# EAGLE design Transmitter (EAGLE 9.2.2)
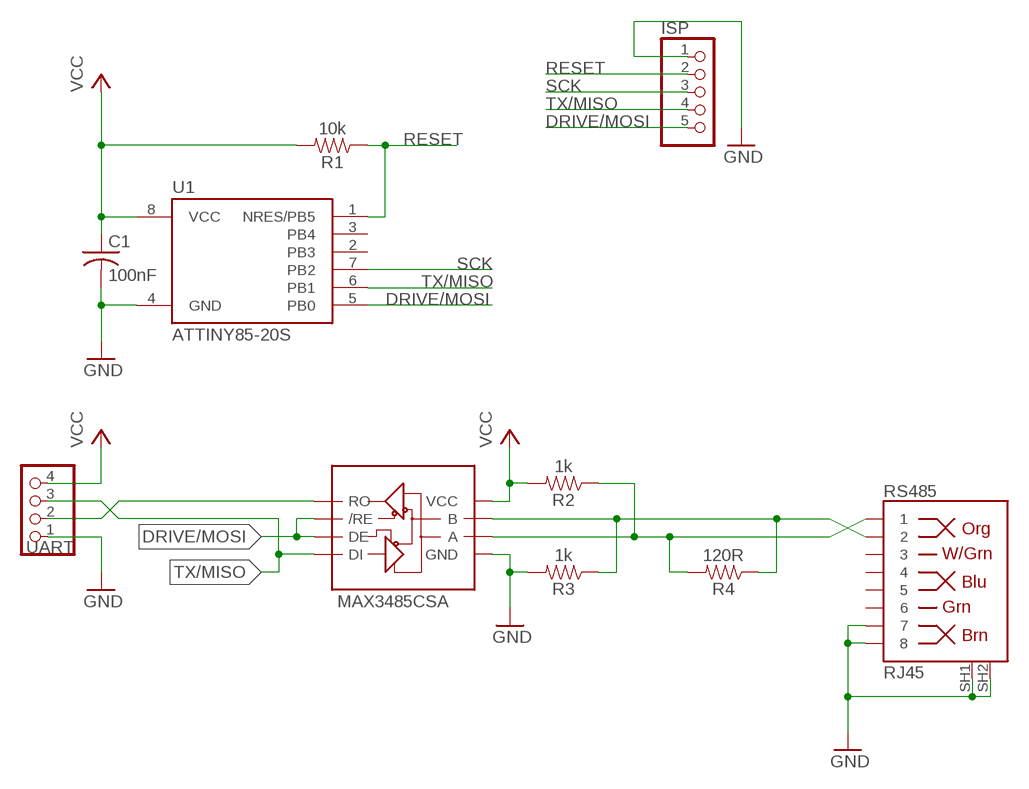
[diagram p0: schematic, sheet 1]

## Parts
C1  100nF  C-USC0603  [C0603]
ISP  PINHD-1X5  [1X05]
R1  10k  10KOHM-0603-1/10W-1%  [0603]
R2  1k  1KOHM-0603-1/10W-1%  [0603]
R3  1k  1KOHM-0603-1/10W-1%  [0603]
R4  120R  RESISTOR0805  [0805]
RS485  RJ45  RJ45-8  [RJ45-8]
U1  ATTINY85-20S  [SOIC8_EIAJ_208MIL]
U2  MAX3485CSA  RS485SOIC  [SO08]
UART  PINHD-1X4  [1X04]

## Nets
A: R2.1 R4.2 RS485.1 U2.6(A)
B: R3.1 R4.1 RS485.2 U2.7(B)
DRIVE/MOSI: ISP.5 U1.5(PB0) U2.2(/RE) U2.3(DE)
GND: C1.2 ISP.1 R3.2 RS485.7 RS485.8 RS485.SH1 RS485.SH2 U1.4(GND) U2.5(GND) UART.1
RESET: ISP.2 R1.1 U1.1(NRES/PB5)
RX: U2.1(RO) UART.2
SCK: ISP.3 U1.7(PB2)
TX/MISO: ISP.4 U1.6(PB1) U2.4(DI) UART.3
VCC: C1.1 R1.2 R2.2 U1.8(VCC) U2.8(VCC) UART.4
Unconnected: RS485.3 RS485.4 RS485.5 RS485.6 U1.2(PB3) U1.3(PB4)

## Library data of the parts
C1 = adafruit:C-US: CAPACITOR, American symbol; MPN: CC0201KRX5R5BB104; OC_NEWARK: 68R4547
ISP = pinhead:PINHD-1X5: PIN HEADER; OC_NEWARK: unknown
R1 = SparkFun-Resistors:10KOHM: 10kΩ resistor A resistor is a passive two-terminal electrical component that implements electrical resistance as a circuit element. Resistors act to reduce current flow, and, at the same time, act to lower voltage levels within circuits. - Wikipedia; OC_NEWARK: unknown; PROD_ID: RES-00824
R2 R3 = SparkFun-Resistors:1KOHM: 1kΩ resistor A resistor is a passive two-terminal electrical component that implements electrical resistance as a circuit element. Resistors act to reduce current flow, and, at the same time, act to lower voltage levels within circuits. - Wikipedia; OC_NEWARK: unknown; PROD_ID: RES-07856
R4 = SparkFun-Resistors:RESISTOR: Generic Resistor Package; OC_NEWARK: unknown
RS485 = SparkFun-Connectors-MyRJ:RJ45-8: RJ45 Jack - 8 pin Simple RJ45, 8-pin connection. Commonly used for Cat5, Cat5e, and Cat6 Ethernet cables. Here is the connector we sell at SparkFun: RJ45 8-Pin Connector <https://www.sparkfun.com/products/643> (PRT-00643) Datasheet <https://cdn.sparkfun.com/datasheets/Prototyping/04908.pdf> It is used on this SparkFun product: SparkFun RJ45 Breakout <https://www.sparkfun.com/products/716> (BOB-00716) Note, you may also be interested in the "MAGJACK" version of this. It is basically a RJ45 connector, but also has some status LEDs built into the connector housing. You can check that out in this library at the device named "MAGJACK.dev" and see these products online: RJ45 Ethernet MagJack-Compatible <https://www.sparkfun.com/products/8534> (PRT-08534) SparkFun RJ45 MagJack Breakout <https://www.sparkfun.com/products/13021> (BOB-13021); OC_NEWARK: unknown; PROD_ID: CONN-08506; SF_ID: PRT-00643
U1 = _hhn_attiny25_45_85:ATTINY85*: ATMEL ATtiny 85 Packages: P = PDIP 08 30mil S = SOIC 08 EIAJ 208mil Technologies Note: for complete ordering code (temp. range, finish, tape&reel etc.) see www.atmel.com • Supply Voltage: V = (1.8…5.5)V | [blank] = (2.7…5.5)V • Speed: 10 = 10 MHz | 20 = 20 MHz Author: Dipl.-Ing. FH Rainer Bayer HHN Hochschule Heilbronn (Heilbronn University), rainer.bayer@hs-heilbronn.de Ingenieurbüro ing-rb, mail@ing-rb.de; OC_NEWARK: unknown
U2 = SparkFun-IC-Comms:RS485: RS-485 Transceiver SP3485 Series 8 Pin NSOIC 3.3 V Low Power Half Duplex RS-485 Transceiver MAX3485 compatible Datasheet <http://www.sparkfun.com/datasheets/Components/General/sp3485CN-LTR.pdf> SparkFun Products SparkFun Transceiver Breakout - RS-485 <https://www.sparkfun.com/products/10124> (BOB-10124) SparkFun USB to RS-485 Converter <https://www.sparkfun.com/products/9822> (BOB-09822); OC_NEWARK: unknown; PROD_ID: IC-09388
UART = pinhead:PINHD-1X4: PIN HEADER; OC_NEWARK: unknown

## Board
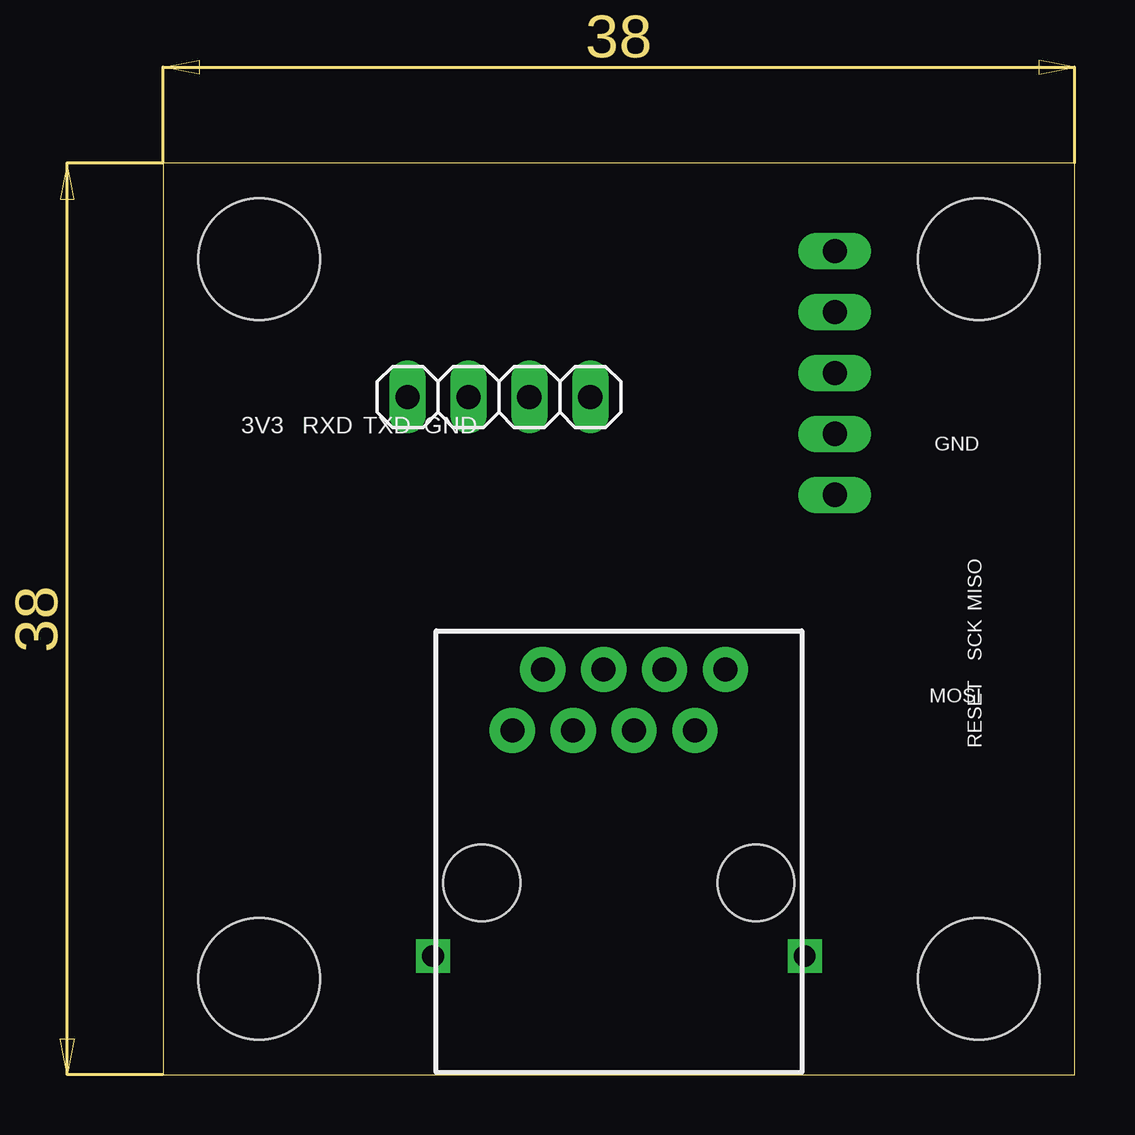
[diagram p1: board, top side]
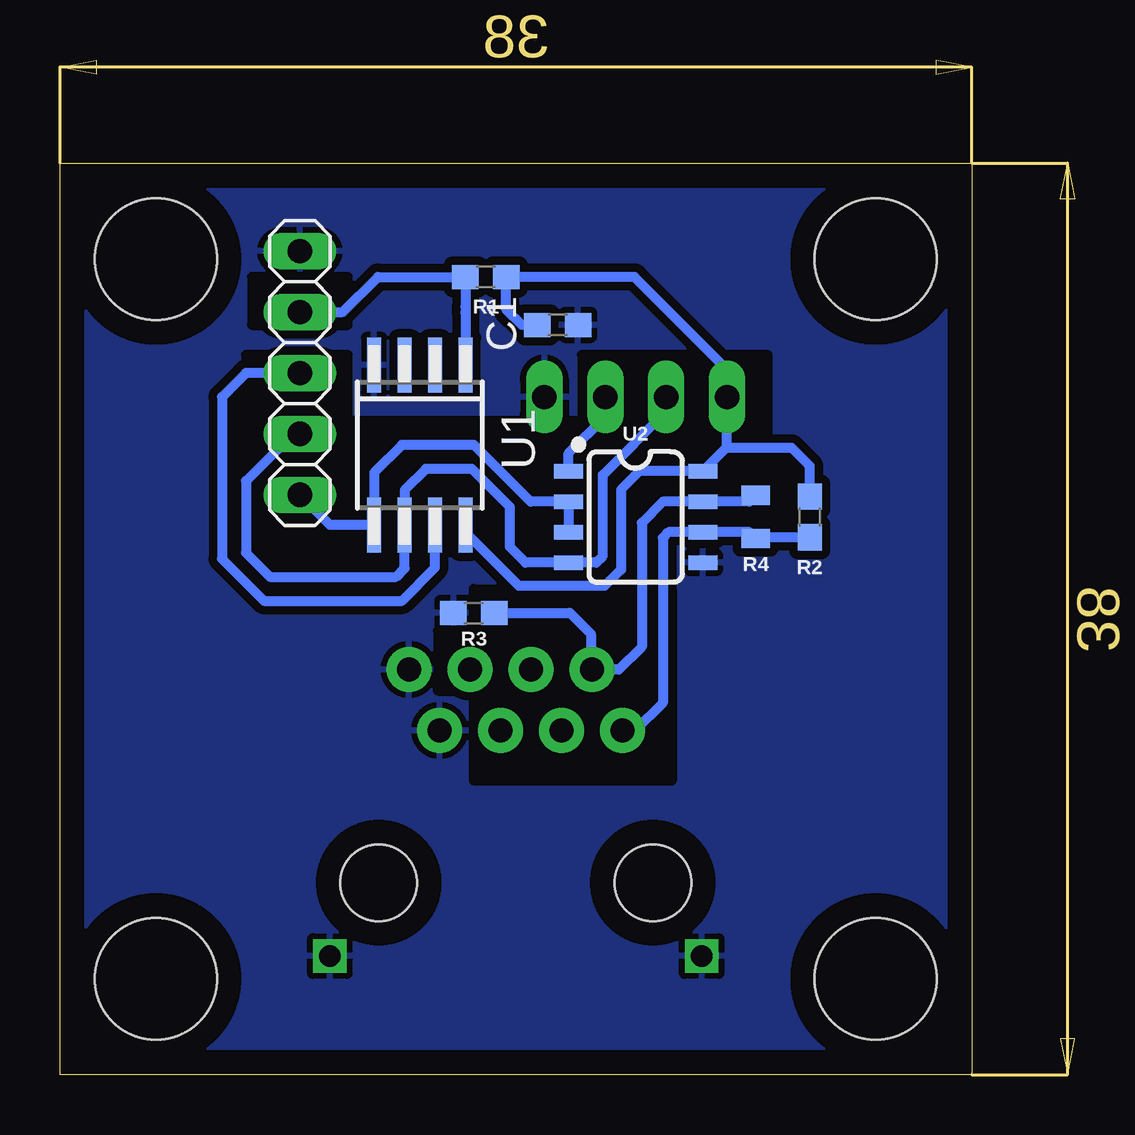
[diagram p2: board, bottom side, seen from below]

Size 38 x 38 mm. Coordinates in mm from the lower left corner, seen from the top.
Outline: 0,0 38,0 38,38 0,38 0,0
Copper layers (1*16): Top 0.035mm / dielectric 1.5mm / Bottom 0.035mm
Design rules "default *": minimum track width 16mil, minimum drill 0.35mm, track to track 14mil, track to pad 12mil, pad to pad 6mil, via to via 6mil, smd to smd 6mil, copper to edge 40mil, drill to drill 6mil, minimum pad ring 10mil, minimum via ring 8mil, stop-mask expansion 4mil, vias tented up to drill 0mil, thermal gap 10mil
Holes 5.08 mm at 4,4 34,4 34,34 4,34
bRestrict: area 12.5,12.2 to 20.8,20.2; area 20,16 to 22.2,18.5; area 26,22.2 to 30.2,30; area 26,31.2 to 30,33.2; area 8.5,26.2 to 16.2,30; area 16.2,24.5 to 26,27.2

### Footprints (pad centres in the part's own frame; a part is rotated, then mirrored left to right if it is on the bottom)
C0603 = smd 1.1 x 1: 1 -0.85,0; 2 0.85,0
1X05 = drill 1.016 long: 1 -5.08,0; 2 -2.54,0; 3 0,0; 4 2.54,0; 5 5.08,0
0603 = smd 1.1 x 1: 1 -0.85,0; 2 0.85,0
0805 = smd 0.8 x 1.2: 1 -0.9,0; 2 0.9,0
RJ45-8 = drill 1 pad 1.88: 1 -4.445,6.35; 2 -3.175,8.89; 3 -1.905,6.35; 4 -0.635,8.89; 5 0.635,6.35; 6 1.905,8.89; 7 3.175,6.35; 8 4.445,8.89 | drill 0.9 square: SH1 -7.75,-3.05; SH2 7.75,-3.05 | hole 3.2: -5.715,0; 5.715,0
SOIC8_EIAJ_208MIL = smd 0.6 x 2.286: 1 -1.905,-3.33; 2 -0.635,-3.33; 3 0.635,-3.33; 4 1.905,-3.33; 5 1.905,3.33; 6 0.635,3.33; 7 -0.635,3.33; 8 -1.905,3.33
SO08 = smd 0.6 x 1.2: 1 -1.905,-2.8; 2 -0.635,-2.8; 3 0.635,-2.8; 4 1.905,-2.8; 5 1.905,2.8; 6 0.635,2.8; 7 -0.635,2.8; 8 -1.905,2.8
1X04 = drill 1.016 long: 1 -3.81,0; 2 -1.27,0; 3 1.27,0; 4 3.81,0

### Placement (x,y rotation side)
C1  17.25,31.25 0 bottom
ISP  28,29.25 270 bottom
R1  20.25,33.25 0 bottom
R2  6.75,23.25 90 bottom
R3  20.75,19.25 180 bottom
R4  9,23.25 270 bottom
RS485  19,8 0 top
U1  23,26.25 180 bottom
U2  14,23.25 270 bottom
UART  14,28.25 180 top

### Tracks (layer width: path | path; a pad name or v marks a point on that pad's centre or on a via)
A
  Bottom 0.406: RS485.1 14.03,14.35 12.88,15.5 12.88,22.38 12.63,22.61 U2.6 9.27,22.61 R4.2 8.95,22.4 R2.1
B
  Bottom 0.406: R4.1 9.27,23.89 U2.7 12.87,23.89 13.75,23 13.75,17.84 14.7,16.89 RS485.2 15.88,16.94 15.88,18.38 16.75,19.25 R3.1
DRIVE/MOSI
  Bottom 0.406: U2.3 U2.2 18.39,23.89 20.75,26.25 23.75,26.25 24.91,25.09 U1.5 26.75,22.92 ISP.5
GND
  pour Bottom: 0,38 0,0 38,0 38,38
RESET
  Bottom 0.406: U1.1 21.1,31.75 21.1,32 R1.1 24.75,33.25 26.21,31.79 ISP.2
RX
  Bottom 0.406: U2.1 16.8,25.91 15.27,27.43 UART.2
SCK
  Bottom 0.406: ISP.3 30.25,29.25 31.25,28.25 31.25,21.5 29.5,19.75 23.75,19.75 22.36,21.14 U1.7
TX/MISO
  Bottom 0.406: UART.3 12.73,27.64 15.38,25 15.38,21.62 15.65,21.34 U2.4 18.59,21.34 19.25,22 19.25,23.67 20.83,25.25 22.75,25.25 23.64,24.36 U1.6 23.64,21.11 24,20.75 29.25,20.75 30.25,21.75 30.25,24.75 28.29,26.71 ISP.4
VCC
  Bottom 0.406: 10.19,26.16 U2.8 13.85,25.16 14.61,24.39 14.61,21.06 15.3,20.38 18.88,20.38 21.09,22.59 U1.8 | 10.19,26.16 UART.4 10.19,29.39 14.05,33.25 R1.2 19.4,31.9 18.75,31.25 C1.1 | R2.2 6.75,25.38 7.5,26.12 10.15,26.12 10.19,26.16

### Text on the board
tNames: 3V3 | RXD | TXD | GND | GND | MISO | SCK | MOSI | RESET